# Altium project ESP32-Ethernet-CAN-IR-Relay.PrjPCB
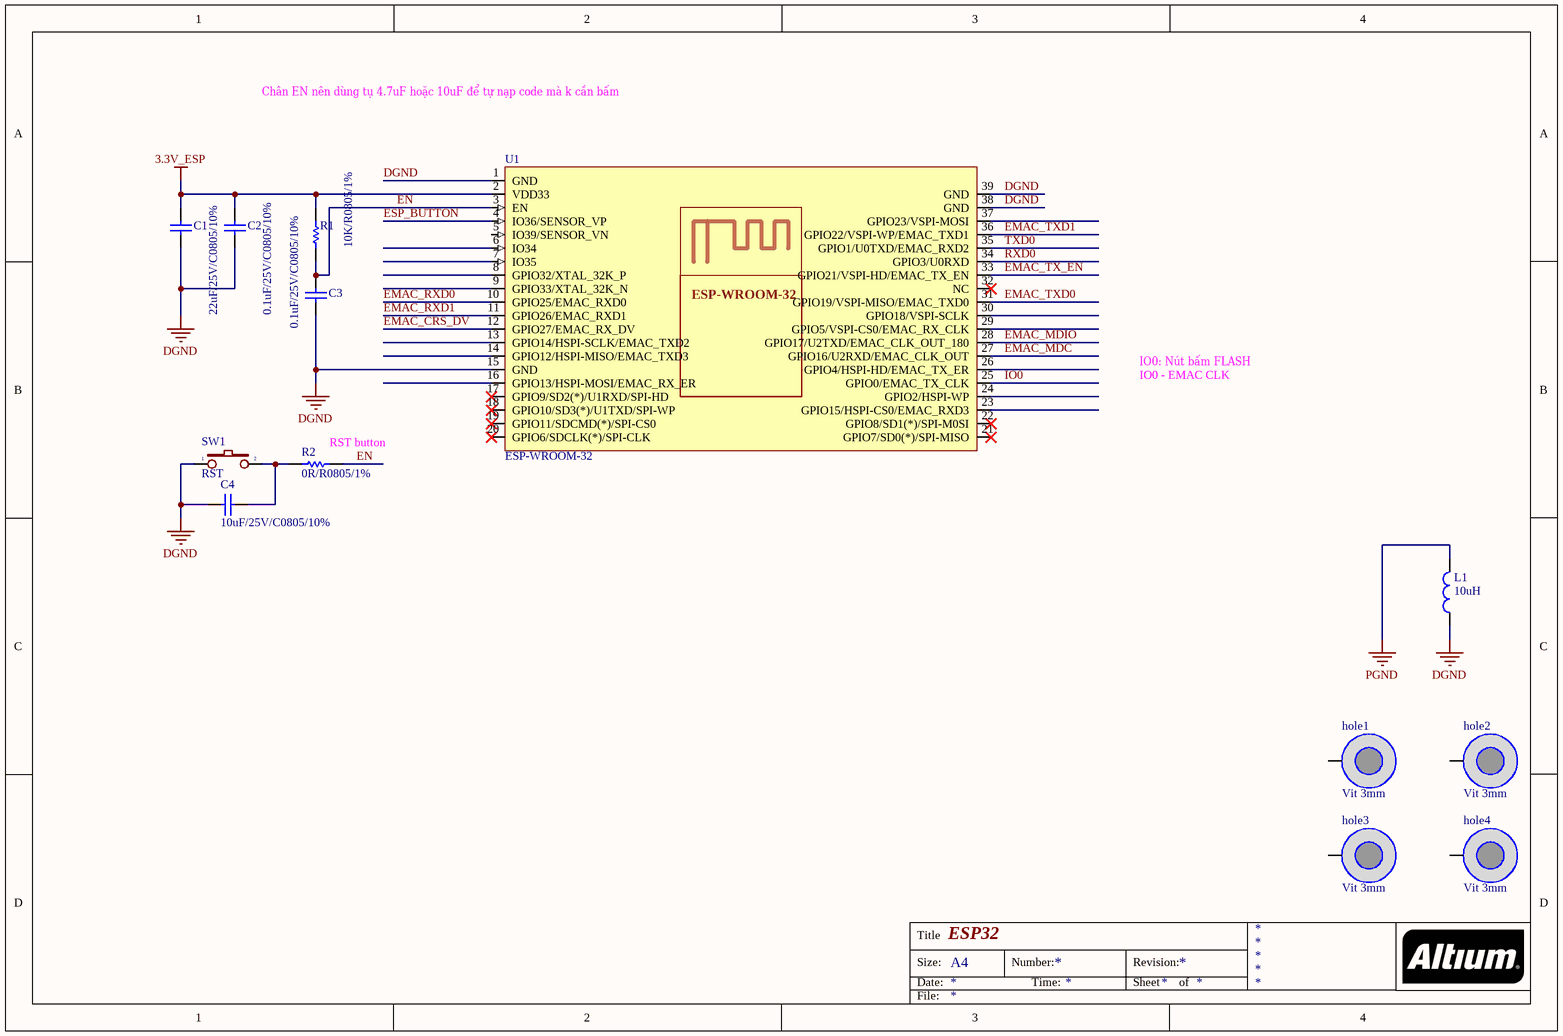
[diagram p0: ESP32.SchDoc]
7 sheets, 158 parts. Net scope: global (net labels, ports and power ports of the same name join across sheets).
Board file: esp_ethernet_can_ir_relay.PcbDoc
Sheets:
  ESP32.SchDoc
  Ethernet.SchDoc
  Input.SchDoc
  Output.SchDoc
  Power.SchDoc
  USB.SchDoc
  CAN.SchDoc

## Sheet ESP32.SchDoc: ESP32
size A4

### Parts
C1  22uF/25V/C0805/10%  [CAP_CERA_C2012(CC0805INCH)]
C2  0.1uF/25V/C0805/10%  [CAP_CERA_C2012(CC0805INCH)]
C3  0.1uF/25V/C0805/10%  [CAP_CERA_C2012(CC0805INCH)]
C4  10uF/25V/C0805/10%  [CAP_CERA_C2012(CC0805INCH)]
hole1  Vit 3mm  [Screw 3.0]
hole2  Vit 3mm  [Screw 3.0]
hole3  Vit 3mm  [Screw 3.0]
hole4  Vit 3mm  [Screw 3.0]
L1  10uH  [L/0.4]
R1  10K/R0805/1%  [Res 0805 SMD]
R2  0R/R0805/1%  [Res 0805 SMD]
SW1  RST  [Button 3x4mm]
U1  ESP-WROOM-32  [ESP32 WROOM]

### Nets
3.3V_ESP: C1.2 C2.2 R1.1 U1.2(VDD33)
DGND: C1.1 C2.1 C3.1 C4.2 L1.1 SW1.1 U1.1(GND) U1.15(GND) U1.38(GND) U1.39(GND)
PGND: L1.2
EMAC_CRS_DV: U1.12(GPIO27/EMAC_RX_DV)
EMAC_MDC: U1.27(GPIO16/U2RXD/EMAC_CLK_OUT)
EMAC_MDIO: U1.28(GPIO17/U2TXD/EMAC_CLK_OUT_180)
EMAC_RXD0: U1.10(GPIO25/EMAC_RXD0)
EMAC_RXD1: U1.11(GPIO26/EMAC_RXD1)
EMAC_TX_EN: U1.33(GPIO21/VSPI-HD/EMAC_TX_EN)
EMAC_TXD0: U1.31(GPIO19/VSPI-MISO/EMAC_TXD0)
EMAC_TXD1: U1.36(GPIO22/VSPI-WP/EMAC_TXD1)
EN: C3.2 R1.2 R2.2 U1.3(EN)
ESP_BUTTON: U1.4(IO36/SENSOR_VP)
IO0: U1.25(GPIO0/EMAC_TX_CLK)
RXD0: U1.34(GPIO3/U0RXD)
TXD0: U1.35(GPIO1/U0TXD/EMAC_RXD2)
NetC4_1: C4.1 R2.1 SW1.2

Not connected (* = marked no-connect by the designer): hole1 1(hole); hole2 1(hole); hole3 1(hole); hole4 1(hole); U1 5(IO39/SENSOR_VN) 6(IO34) 7(IO35) 8(GPIO32/XTAL_32K_P) 9(GPIO33/XTAL_32K_N) 13(GPIO14/HSPI-SCLK/EMAC_TXD2) 14(GPIO12/HSPI-MISO/EMAC_TXD3) 16(GPIO13/HSPI-MOSI/EMAC_RX_ER) 17(GPIO9/SD2(*)/U1RXD/SPI-HD)* 18(GPIO10/SD3(*)/U1TXD/SPI-WP)* 19(GPIO11/SDCMD(*)/SPI-CS0)* 20(GPIO6/SDCLK(*)/SPI-CLK)* 21(GPIO7/SD0(*)/SPI-MISO)* 22(GPIO8/SD1(*)/SPI-M0SI)* 23(GPIO15/HSPI-CS0/EMAC_RXD3) 24(GPIO2/HSPI-WP) 26(GPIO4/HSPI-HD/EMAC_TX_ER) 29(GPIO5/VSPI-CS0/EMAC_RX_CLK) 30(GPIO18/VSPI-SCLK) 32(NC)* 37(GPIO23/VSPI-MOSI)

### Notes on the sheet
- Chân EN nên dùng tụ 4.7uF hoặc 10uF để tự nạp code mà k cần bấm
- IO0: Nút bấm FLASH
- IO0 - EMAC CLK
- (near R2) RST button
- Title
- Size:
- Date:
- A4
- Number:
- Time:
- Revision:
- Sheet
- of
- File:

### Library data of the parts
C1 = 0.1uF/50V/C0603/10%: 22µF ±20% 25V Ceramic Capacitor X5R 0805 (2012 Metric); Manufacturer: Tariff Applied; ComponentLink1URL: http://www.murata.com/~/media/webrenewal/support/library/catalog/products/capacitor/mlcc/c02e.ashx; ComponentLink1Description: http://www.murata.com/~/media/webrenewal/support/library/catalog/products/capacitor/mlcc/c02e.ashx; Digikey: 1276-2908-1-ND
C2-C4 = 0.1uF/50V/C0603/10%: 0.1µF ±10% 25V Ceramic Capacitor X7R 0805 (2012 Metric); ComponentLink1URL: http://www.murata.com/~/media/webrenewal/support/library/catalog/products/capacitor/mlcc/c02e.ashx; ComponentLink1Description: http://www.murata.com/~/media/webrenewal/support/library/catalog/products/capacitor/mlcc/c02e.ashx; Digikey: 478-3755-1-ND
L1 = L1: Inductor; Value: 150 mH
R1 = 200K/R0603/1%: 10 kOhms ±1% 0.125W, 1/8W Chip Resistor 0805 (2012 Metric) Thick Film; Power (Watts): 0.1W, 1/10W; RoHS: RoHS Compliant; Category: Resistors; Part Status: Active; Features: Moisture Resistant; Operating Temperature: -55°C ~ 155°C; Package / Case: 0603 (1608 Metric); Supplier Device Package: 0603; Size / Dimension: 0.063" L x 0.031" W (1.60mm x 0.80mm); Height - Seated (Max): 0.022" (0.55mm); Failure Rate: -; ComponentLink1URL: http://www.yageo.com/documents/recent/PYu-RC_Group_51_RoHS_L_7.pdf; ComponentLink1Description: http://www.yageo.com/documents/recent/PYu-RC_Group_51_RoHS_L_7.pdf; Digikey: A126332CT-ND
R2 = 200K/R0603/1%: 0 Ohms Jumper 0.125W, 1/8W Chip Resistor 0805 (2012 Metric) Automotive AEC-Q200 Thick Film; Part Status: Active; Height - Seated (Max): 0.022" (0.55mm); Failure Rate: -; ComponentLink1URL: http://www.yageo.com/documents/recent/PYu-RC_Group_51_RoHS_L_7.pdf; ComponentLink1Description: http://www.yageo.com/documents/recent/PYu-RC_Group_51_RoHS_L_7.pdf; Digikey: 541-0.0ACT-ND
SW1 = SW2: SWITCH TACTILE SPST-NO 0.05A 12V; Digikey: CKN10384CT-ND
U1 = ESP-WROOM-32: ESP-WROOM-32 (8MB), WIFI MODULE 64 MBITS SPI FLASH; Digikey: 1904-1019-1-ND

## Sheet Ethernet.SchDoc: Ethernet
size A3
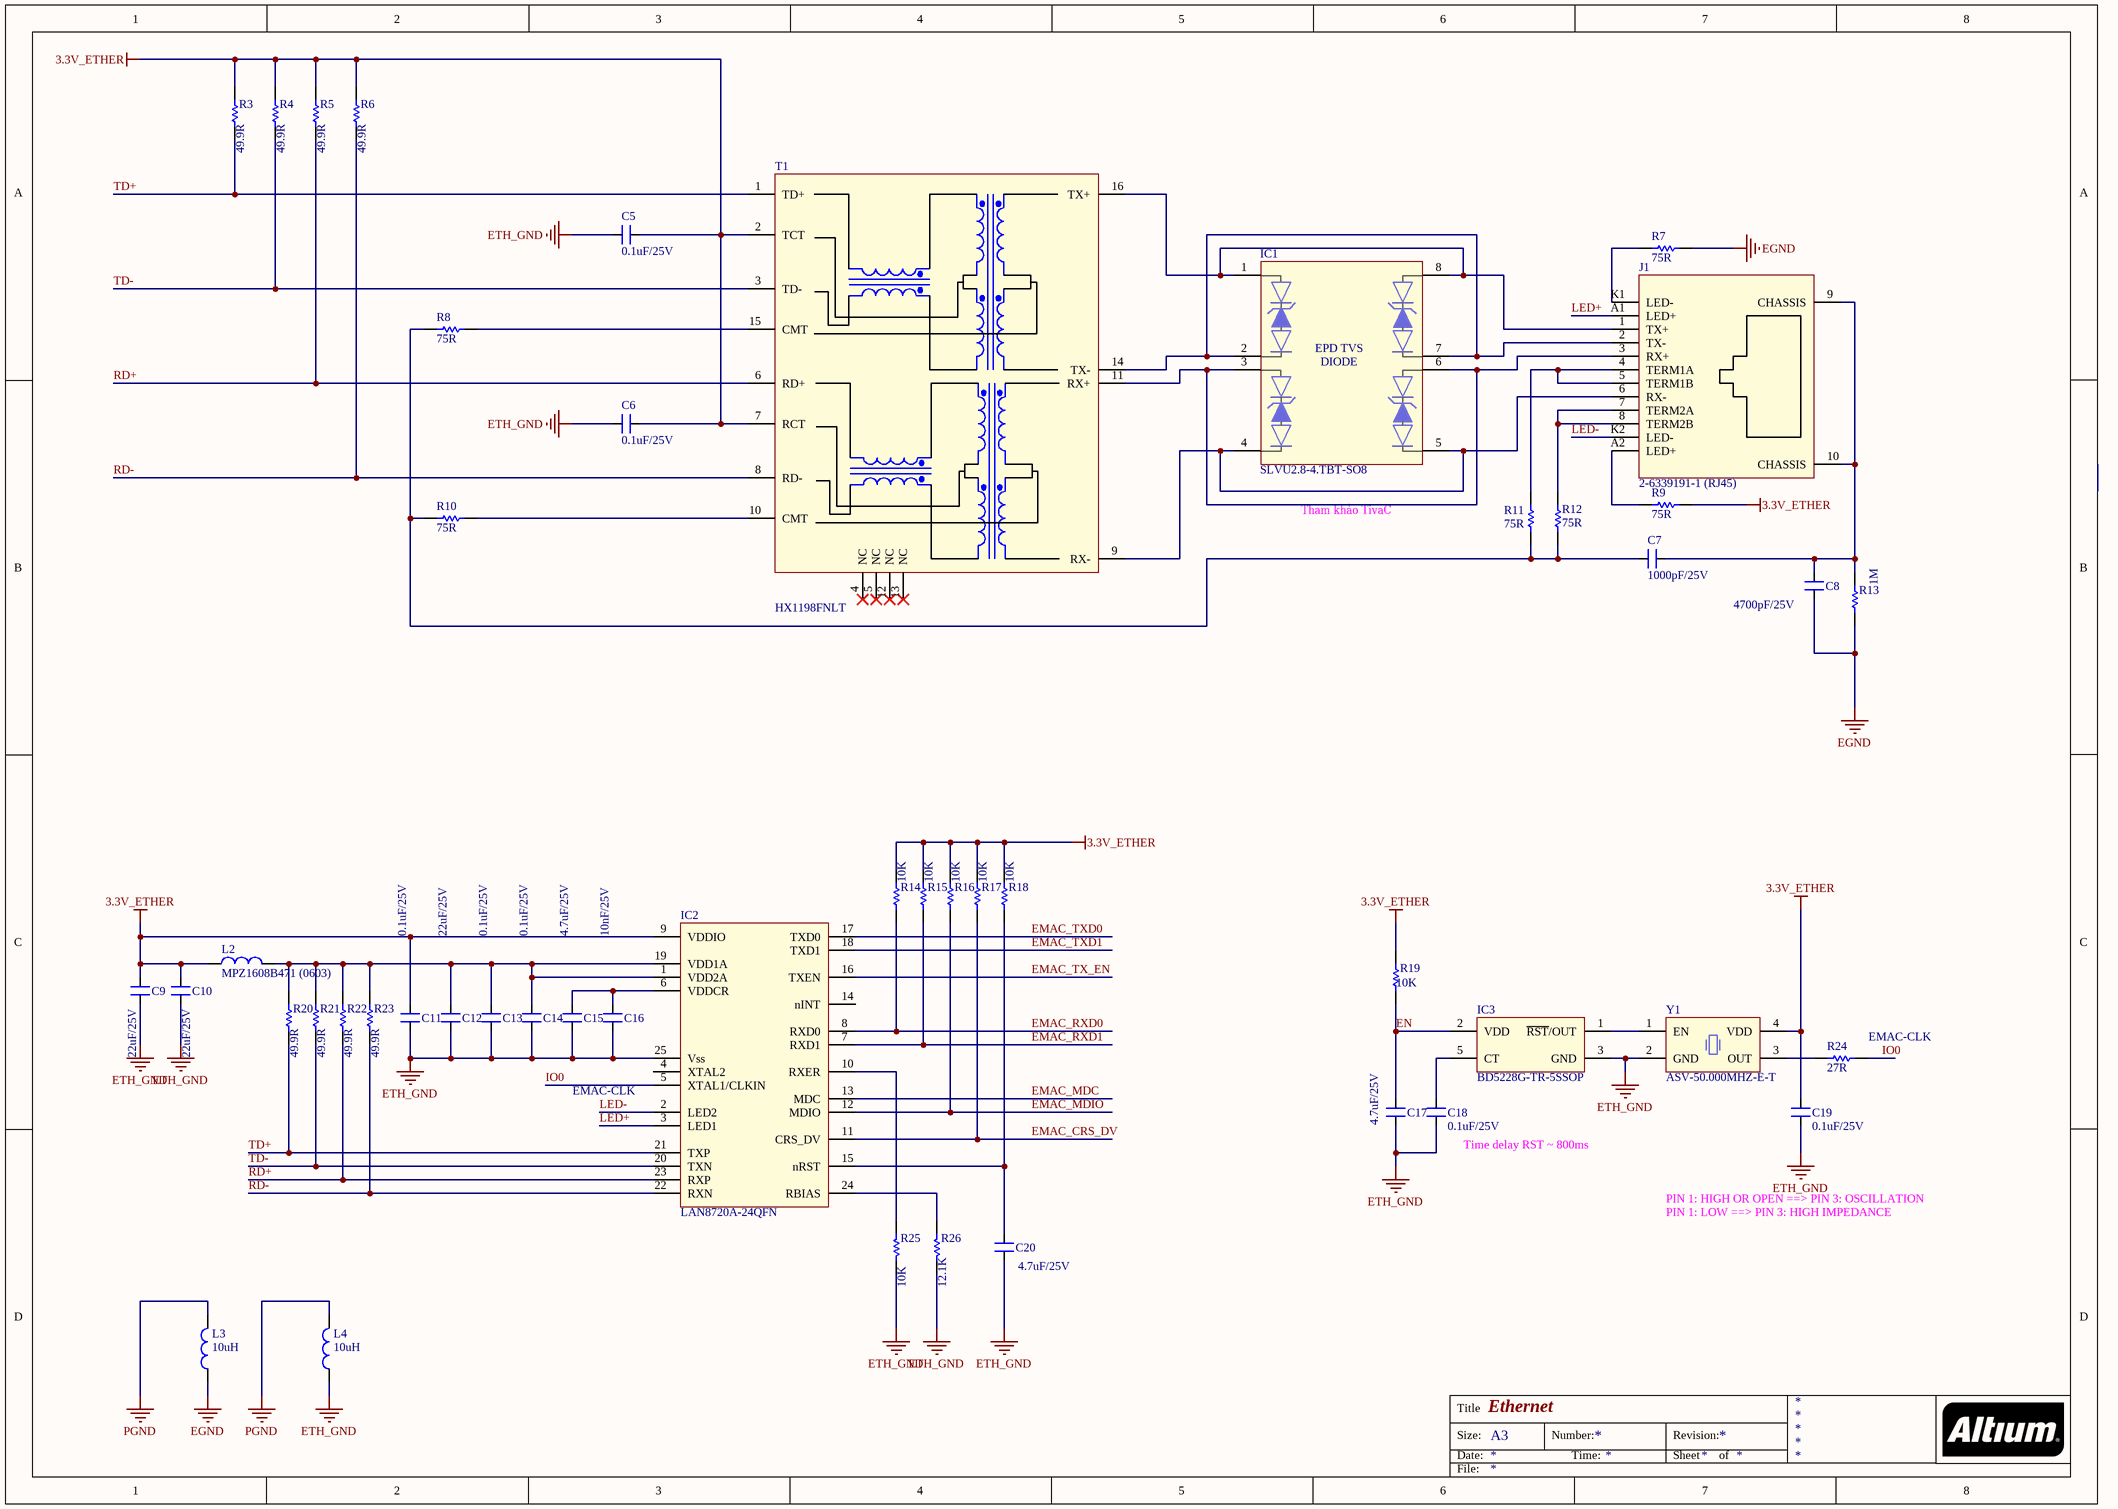
[diagram p1: Ethernet.SchDoc]

### Parts
C5  0.1uF/25V  [CAP_CERA_C2012(CC0805INCH)]
C6  0.1uF/25V  [CAP_CERA_C2012(CC0805INCH)]
C7  1000pF/25V  [CAP_CERA_C2012(CC0805INCH)]
C8  4700pF/25V  [CAP_CERA_C2012(CC0805INCH)]
C9  22uF/25V  [CAP_CERA_C2012(CC0805INCH)]
C10  22uF/25V  [CAP_CERA_C2012(CC0805INCH)]
C11  0.1uF/25V  [CAP_CERA_C2012(CC0805INCH)]
C12  22uF/25V  [CAP_CERA_C2012(CC0805INCH)]
C13  0.1uF/25V  [CAP_CERA_C2012(CC0805INCH)]
C14  0.1uF/25V  [CAP_CERA_C2012(CC0805INCH)]
C15  4.7uF/25V  [CAP_CERA_C2012(CC0805INCH)]
C16  10nF/25V  [CAP_CERA_C2012(CC0805INCH)]
C17  4.7uF/25V  [CAP_CERA_C2012(CC0805INCH)]
C18  0.1uF/25V  [CAP_CERA_C2012(CC0805INCH)]
C19  0.1uF/25V  [CAP_CERA_C2012(CC0805INCH)]
C20  4.7uF/25V  [CAP_CERA_C2012(CC0805INCH)]
IC1  SLVU2.8-4.TBT-SO8  [SLVU2.8-4.TBT - 8S0]
IC2  LAN8720A-24QFN  [LAN8720A 24QFN]
IC3  BD5228G-TR-5SSOP  [BD5228G -5SSOP]
J1  2-6339191-1 (RJ45)  [RJ45-A121555CT-ND]
L2  MPZ1608B471 (0603)  [MPZ1608B471]
L3  10uH  [L/0.4]
L4  10uH  [L/0.4]
R3  49.9R  [Res 0805 SMD]
R4  49.9R  [Res 0805 SMD]
R5  49.9R  [Res 0805 SMD]
R6  49.9R  [Res 0805 SMD]
R7  75R  [Res 0805 SMD]
R8  75R  [Res 0805 SMD]
R9  75R  [Res 0805 SMD]
R10  75R  [Res 0805 SMD]
R11  75R  [Res 0805 SMD]
R12  75R  [Res 0805 SMD]
R13  1M  [Res 0805 SMD]
R14  10K  [Res 0805 SMD]
R15  10K  [Res 0805 SMD]
R16  10K  [Res 0805 SMD]
R17  10K  [Res 0805 SMD]
R18  10K  [Res 0805 SMD]
R19  10K  [Res 0805 SMD]
R20  49.9R  [Res 0805 SMD]
R21  49.9R  [Res 0805 SMD]
R22  49.9R  [Res 0805 SMD]
R23  49.9R  [Res 0805 SMD]
R24  27R  [Res 0805 SMD]
R25  10K  [Res 0805 SMD]
R26  12.1K  [Res 0805 SMD]
T1  HX1198FNLT  [HX1198FNL]
Y1  ASV-50.000MHZ-E-T  [CR_ASV_50.000MHZ]

### Nets
3.3V_ETHER: C5.1 C6.1 C9.2 C10.2 C11.2 C19.2 IC2.9(VDDIO) L2.1 R3.1 R4.1 R5.1 R6.1 R9.1 R14.1 R15.1 R16.1 R17.1 R18.1 R19.1 T1.2(TCT) T1.7(RCT) Y1.4(VDD)
EGND: C8.2 L3.1 R7.1 R13.1
ETH_GND: C5.2 C6.2 C9.1 C10.1 C11.1 C12.1 C13.1 C14.1 C15.1 C16.1 C17.1 C18.1 C19.1 C20.1 IC2.25(Vss) IC3.3(GND) L4.1 R25.2 R26.2 Y1.2(GND)
PGND: L3.2 L4.2
EMAC_CRS_DV: IC2.11(CRS_DV) R17.2
EMAC_MDC: IC2.13(MDC)
EMAC_MDIO: IC2.12(MDIO) R16.2
EMAC_RXD0: IC2.8(RXD0) R14.2
EMAC_RXD1: IC2.7(RXD1) R15.2
EMAC_TX_EN: IC2.16(TXEN)
EMAC_TXD0: IC2.17(TXD0)
EMAC_TXD1: IC2.18(TXD1)
EN: C17.2 IC3.2(VDD) R19.2
IO0: IC2.5(XTAL1/CLKIN) R24.2
LED+: IC2.3(LED1) J1.A1(LED+)
LED-: IC2.2(LED2) J1.K2(LED-)
RD+: IC2.23(RXP) R5.2 R22.1 T1.6(RD+)
RD-: IC2.22(RXN) R6.2 R23.1 T1.8(RD-)
TD+: IC2.21(TXP) R3.2 R20.1 T1.1(TD+)
TD-: IC2.20(TXN) R4.2 R21.1 T1.3(TD-)
NetC7_1: C7.1 C8.1 J1.9(CHASSIS) J1.10(CHASSIS) R13.2
NetC7_2: C7.2 R8.2 R10.2 R11.1 R12.1
NetC12_2: C12.2 C13.2 C14.2 IC2.1(VDD2A) IC2.19(VDD1A) L2.2 R20.2 R21.2 R22.2 R23.2
NetC15_2: C15.2 C16.2 IC2.6(VDDCR)
NetC18_2: C18.2 IC3.5(CT)
NetC20_2: C20.2 IC2.15(nRST) R18.2
NetIC1_1: IC1.1(A1) IC1.8(A1) J1.1(TX+) T1.16(TX+)
NetIC1_2: IC1.2(K1) IC1.7(K1) J1.2(TX-) T1.14(TX-)
NetIC1_3: IC1.3(A1) IC1.6(A1) J1.3(RX+) T1.11(RX+)
NetIC1_4: IC1.4(K1) IC1.5(K1) J1.6(RX-) T1.9(RX-)
NetIC2_10: IC2.10(RXER) R25.1
NetIC2_24: IC2.24(RBIAS) R26.1
NetIC3_1: IC3.1(~{RST}/OUT) Y1.1(EN)
NetJ1_4: J1.4(TERM1A) J1.5(TERM1B) R11.2
NetJ1_7: J1.7(TERM2A) J1.8(TERM2B) R12.2
NetJ1_A2: J1.A2(LED+) R9.2
NetJ1_K1: J1.K1(LED-) R7.2
NetR8_1: R8.1 T1.15(CMT)
NetR10_1: R10.1 T1.10(CMT)
NetR24_1: R24.1 Y1.3(OUT)

Not connected (* = marked no-connect by the designer): IC2 4(XTAL2) 14(nINT); T1 4(NC)* 5(NC)* 12(NC)* 13(NC)*

### Notes on the sheet
- Tham khảo TivaC
- (near R24) EMAC-CLK
- EMAC-CLK
- (near C18) Time delay RST ~ 800ms
- PIN 1: HIGH OR OPEN ==> PIN 3: OSCILLATION
- PIN 1: LOW ==> PIN 3: HIGH IMPEDANCE
- Title
- Size:
- Date:
- A3
- Number:
- Time:
- Revision:
- Sheet
- of
- File:
- (in symbol SLVU2.8-4.TBT) EPD TVS; DIODE

### Library data of the parts
C5 C6 C11 C13 C14 C18 C19 = CAP CERA 0805: 0.1µF ±10% 25V Ceramic Capacitor X7R 0805 (2012 Metric); Value: 100pF, 2012; Digikey: 478-3755-1-ND
C7 = CAP CERA 0805: 1000pF ±10% 25V Ceramic Capacitor X7R 0805 (2012 Metric); Manufacturrer: Wurth Electronics Inc.; Digikey: 732-8050-1-ND
C8 = CAP CERA 0805: 4700pF ±10% 25V Ceramic Capacitor X7R 0805 (2012 Metric); Manufacturrer: KEMET; Digikey: 399-14606-1-ND
C9 C10 C12 = CAP CERA 0805: 22µF ±20% 25V Ceramic Capacitor X5R 0805 (2012 Metric); Digikey: 1276-2908-1-ND
C15 C17 C20 = CAP CERA 0805: 4.7µF ±10% 25V Ceramic Capacitor X5R 0805 (2012 Metric); Digikey: 399-5505-1-ND
C16 = CAP CERA 0805: 1nF=1000pF ±10% 25V Ceramic Capacitor X7R 0805 (2012 Metric); Digikey: 399-7994-1-ND
IC1 = SLVU2.8-4.TBT: TVS DIODE 2.8V 15V 8SO, EPD TVS Diode Array For ESD and Latch-Up Protection; Digikey: SLVU2.8-4CT-ND
IC2 = LAN8720A-24QFN: IC TXRX ETHERNET 24QFN,  2/2 Transceiver Full RMII 24-QFN (4x4); Digikey: LAN8720A-CP-CT-ND
IC3 = BD5228G-5SSOP: IC DETECTOR VOLT 2.8V ODRN 5SSOP; Digikey: BD5228GCT-ND
J1 = RJ45-2-6339191-1: Jack Modular Connector 8p8c (RJ45, Ethernet) 90° Angle (Right) Shielded, EMI Finger Cat5; Digikey: A121555CT-ND
L2 = L1: FERRITE BEAD 470 OHM 0603 1LN; Digikey: 445-5218-1-ND
L3 L4 = L1: Inductor; Value: 150 mH
R3-R6 R20-R23 = RES-0805: 49.9 Ohms ±1% 0.15W Chip Resistor 0805 (2012 Metric) Military Thick Film; ComponentLink1URL: http://www.yageo.com/documents/recent/PYu-RC_Group_51_RoHS_L_8.pdf; ComponentLink1Description: http://www.yageo.com/documents/recent/PYu-RC_Group_51_RoHS_L_8.pdf; Digikey: 1135-1012-1-ND
R7-R12 = RES-0805: 75 Ohms ±1% 0.125W, 1/8W Chip Resistor 0805 (2012 Metric) Automotive AEC-Q200 Thick Film; ComponentLink1URL: http://www.yageo.com/documents/recent/PYu-RC_Group_51_RoHS_L_8.pdf; ComponentLink1Description: http://www.yageo.com/documents/recent/PYu-RC_Group_51_RoHS_L_8.pdf; Digikey: P75.0CCT-ND
R13 = RES-0805: 1 MOhms ±1% 0.125W, 1/8W Chip Resistor 0805 (2012 Metric) Automotive AEC-Q200 Thick Film; ComponentLink1URL: http://www.yageo.com/documents/recent/PYu-RC_Group_51_RoHS_L_8.pdf; ComponentLink1Description: http://www.yageo.com/documents/recent/PYu-RC_Group_51_RoHS_L_8.pdf; Digikey: P1.00MCCT-ND
R14-R19 R25 = RES-0805: RES SMD 249K OHM 1% 1/10W 0805; Manufacturer: Yageo; Manufacturer Part Number: RC0603FR-07249KL; Power (Watts): 0.1W, 1/10W; Temperature Coefficient: ±100ppm/°C; Supplier 1: Digi-Key; RoHS: RoHS Compliant; Category: Resistors; Stock 1: 370515; Pricing 1: 1=0.1, 10=0.015, 100=0.006, 1000=0.00268, 2500=0.00233 (USD); Packaging: Cut Tape (CT); Part Status: Active; Tolerance: ±1%; Composition: Thick Film; Features: Moisture Resistant; Operating Temperature: -55°C ~ 155°C; Package / Case: 0603 (1608 Metric); Supplier Device Package: 0603; Size / Dimension: 0.063" L x 0.032" W (1.60mm x 0.80mm); Height - Seated (Max): 0.022" (0.55mm); Failure Rate: -; ComponentLink1URL: http://www.yageo.com/documents/recent/PYu-RC_Group_51_RoHS_L_8.pdf; ComponentLink1Description: http://www.yageo.com/documents/recent/PYu-RC_Group_51_RoHS_L_8.pdf
R24 = RES-0805: 27 Ohms ±1% 0.125W, 1/8W Chip Resistor 0805 (2012 Metric) Automotive AEC-Q200 Thick Fil; ComponentLink1URL: http://www.yageo.com/documents/recent/PYu-RC_Group_51_RoHS_L_8.pdf; ComponentLink1Description: http://www.yageo.com/documents/recent/PYu-RC_Group_51_RoHS_L_8.pdf; Digikey: P27.0CCT-ND
R26 = RES-0805: 12.1 kOhms ±1% 0.125W, 1/8W Chip Resistor 0805 (2012 Metric) Automotive AEC-Q200 Thick Film; ComponentLink1URL: http://www.yageo.com/documents/recent/PYu-RC_Group_51_RoHS_L_8.pdf; ComponentLink1Description: http://www.yageo.com/documents/recent/PYu-RC_Group_51_RoHS_L_8.pdf; Digikey: P12.1KCCT-ND
T1 = HX1198FNLT: PULSE XFMR 1CT:1CT TX 1CT:1CT RX; Digikey: 553-2209-1-ND
Y1 = CRYSTAL_ASV: 50MHz XO (Standard) HCMOS Oscillator 3.3V Enable/Disable 4-SMD, No Lead; ComponentLink1Description: Datasheet; Digikey: 535-10087-1-ND

## Sheet Input.SchDoc: INPUT
size A4
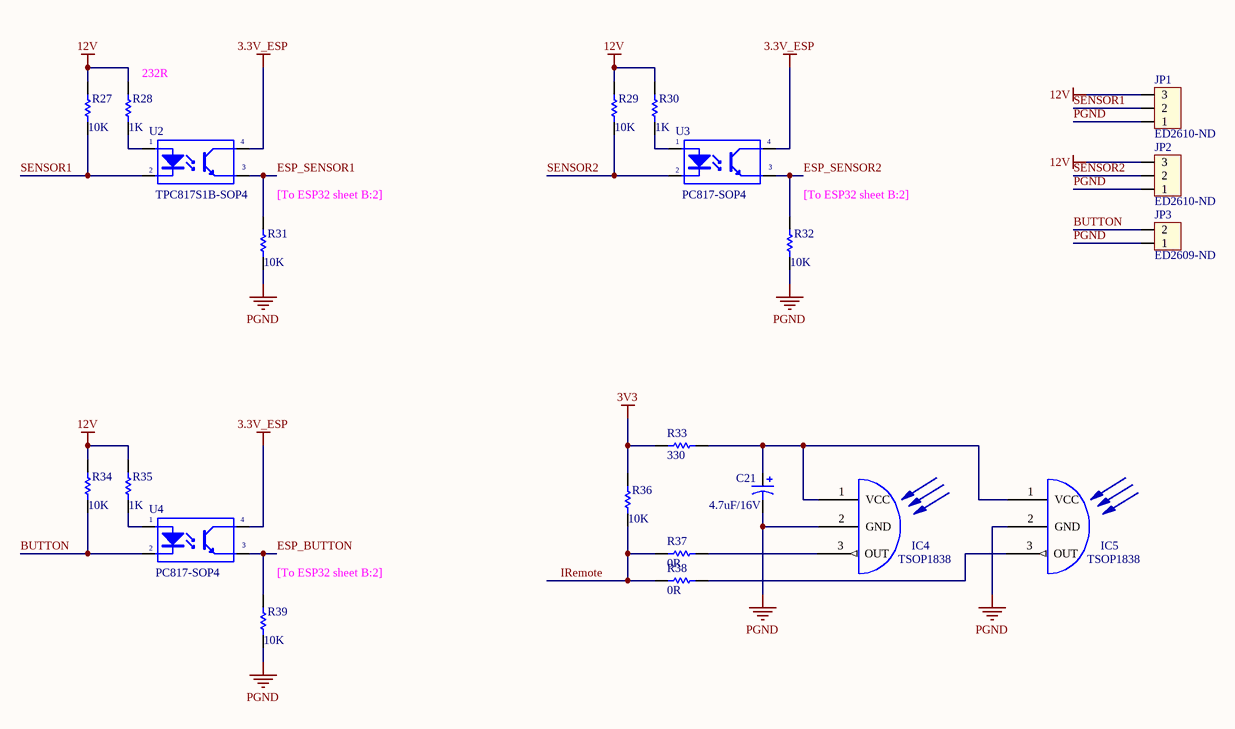
[diagram p2: Input.SchDoc]

### Parts
C21  value 4.7uF/16V  [C0805]  (hidden comment: Cap Pol1)
IC4  TSOP1838  [TSOP1838]
IC5  TSOP1838  [TSOP1838]
JP1  ED2610-ND  [DOMINO_OSTTC_3P]
JP2  ED2610-ND  [DOMINO_OSTTC_3P]
JP3  ED2609-ND  [DOMINO_OSTTC_2P]
R27  10K  [Res 0805 SMD]
R28  1K  [Res 0805 SMD]
R29  10K  [Res 0805 SMD]
R30  1K  [Res 0805 SMD]
R31  10K  [Res 0805 SMD]
R32  10K  [Res 0805 SMD]
R33  330  [Res 0805 SMD]
R34  10K  [Res 0805 SMD]
R35  1K  [Res 0805 SMD]
R36  10K  [Res 0805 SMD]
R37  0R  [Res 0805 SMD]
R38  0R  [Res 0805 SMD]
R39  10K  [Res 0805 SMD]
U2  TPC817S1B-SOP4  [TPC817-4SOP]
U3  PC817-SOP4  [TPC817-4SOP]
U4  PC817-SOP4  [TPC817-4SOP]

### Nets
3.3V_ESP: U2.4(C) U3.4(C) U4.4(C)
3V3: R33.2 R36.2
12V: JP1.3 JP2.3 R27.2 R28.2 R29.2 R30.2 R34.2 R35.2
PGND: C21.2 IC4.2(GND) IC5.2(GND) JP1.1 JP2.1 JP3.1 R31.1 R32.1 R39.1
BUTTON: JP3.2 R34.1 U4.2(K)
ESP_BUTTON: R39.2 U4.3(E)
ESP_SENSOR1: R31.2 U2.3(E)
ESP_SENSOR2: R32.2 U3.3(E)
IRemote: R36.1 R37.2 R38.2
SENSOR1: JP1.2 R27.1 U2.2(K)
SENSOR2: JP2.2 R29.1 U3.2(K)
NetC21_1: C21.1 IC4.1(VCC) IC5.1(VCC) R33.1
NetIC4_3: IC4.3(OUT) R37.1
NetIC5_3: IC5.3(OUT) R38.1
NetR28_1: R28.1 U2.1(A)
NetR30_1: R30.1 U3.1(A)
NetR35_1: R35.1 U4.1(A)

### Notes on the sheet
- (near R28) 232R
- [To ESP32 sheet B:2]
- Title
- Size:
- Date:
- A4
- Number:
- Time:
- Revision:
- Sheet
- of
- File:

### Library data of the parts
C21 = Cap Pol1: Polarized Capacitor (Radial); Published: 8-Jun-2000; LatestRevisionDate: 17-Jul-2002; LatestRevisionNote: Re-released for DXP Platform.; PackageReference: RB7.6-15; Publisher: Altium Limited; PackageDescription: Polarized Capacitor (Radial); 2 Leads
JP1 JP2 = Con3: 3 Position Wire to Board Terminal Block Horizontal with Board 0.200" (5.08mm) Through Hole; Value: Connector 3; Digikey: ED2610-ND
JP3 = Con2: 2 Position Wire to Board Terminal Block Horizontal with Board 0.200" (5.08mm) Through Hole; Value: Connector 2; Digikey: ED2609-ND
R27 R29 R34 = 10K/R0603/1%: RES SMD 10K OHM 1% 1/10W 0603; Manufacturer: Yageo; Manufacturer Part Number: RC0603FR-0710KL; Power (Watts): 0.1W, 1/10W; Temperature Coefficient: ±100ppm/°C; Supplier 1: Digi-Key; RoHS: RoHS Compliant; Category: Resistors; Stock 1: 11440000; Pricing 1: 5000=0.00167, 10000=0.00145, 25000=0.00128, 50000=0.00117, 125000=0.00115 (USD); Packaging: Tape & Reel (TR); Resistance (Ohms): 10k; Tolerance: ±1%; Composition: Thick Film; Features: Moisture Resistant; Operating Temperature: -55°C ~ 155°C; Package / Case: 0603 (1608 Metric); Supplier Device Package: 0603; Size / Dimension: 0.063" L x 0.031" W (1.60mm x 0.80mm); Height: 0.022" (0.55mm); Number of Terminations: 2; ComponentLink1URL: http://www.yageo.com/NewPortal/yageodocoutput?fileName=/pdf/R-Chip/PYu-RC_Group_51_RoHS_L_3.pdf; ComponentLink1Description: http://www.yageo.com/NewPortal/yageodocoutput?fileName=/pdf/R-Chip/PYu-RC_Group_51_RoHS_L_3.pdf; Supplier Part Number 1: 311-10.0KHRTR-ND
R28 R30 R35 = 10K/R0603/1%: 1 kOhms ±1% 0.125W, 1/8W Chip Resistor 0805 (2012 Metric) Automotive AEC-Q200 Thick Film; Resistance (Ohms): 10k; Power (Watts): 0.1W, 1/10W; RoHS: RoHS Compliant; Category: Resistors; Features: Moisture Resistant; Operating Temperature: -55°C ~ 155°C; Package / Case: 0603 (1608 Metric); Supplier Device Package: 0603; Size / Dimension: 0.063" L x 0.031" W (1.60mm x 0.80mm); Height: 0.022" (0.55mm); Number of Terminations: 2; ComponentLink1URL: http://www.yageo.com/NewPortal/yageodocoutput?fileName=/pdf/R-Chip/PYu-RC_Group_51_RoHS_L_3.pdf; ComponentLink1Description: http://www.yageo.com/NewPortal/yageodocoutput?fileName=/pdf/R-Chip/PYu-RC_Group_51_RoHS_L_3.pdf; Digikey: 541-1.00KCCT-ND
R31-R33 R36-R39 = 249K/R0805/1%: RES SMD 249K OHM 1% 1/10W 0805; Manufacturer: Yageo; Manufacturer Part Number: RC0603FR-07249KL; Power (Watts): 0.1W, 1/10W; Temperature Coefficient: ±100ppm/°C; Supplier 1: Digi-Key; RoHS: RoHS Compliant; Category: Resistors; Stock 1: 370515; Pricing 1: 1=0.1, 10=0.015, 100=0.006, 1000=0.00268, 2500=0.00233 (USD); Packaging: Cut Tape (CT); Part Status: Active; Tolerance: ±1%; Composition: Thick Film; Features: Moisture Resistant; Operating Temperature: -55°C ~ 155°C; Package / Case: 0603 (1608 Metric); Supplier Device Package: 0603; Size / Dimension: 0.063" L x 0.032" W (1.60mm x 0.80mm); Height - Seated (Max): 0.022" (0.55mm); Failure Rate: -; ComponentLink1URL: http://www.yageo.com/documents/recent/PYu-RC_Group_51_RoHS_L_8.pdf; ComponentLink1Description: http://www.yageo.com/documents/recent/PYu-RC_Group_51_RoHS_L_8.pdf
U2-U4 = PC817: Optoisolator Transistor Output 5000Vrms 1 Channel 4-SOP; Digikey: TPC817S1BRAGCT-ND
  U3 U4: BuyVN: https://banlinhkien.vn/goods-1134-pc817-el817-sop4-opto.html

## Sheet Output.SchDoc: OUTPUT
size A4
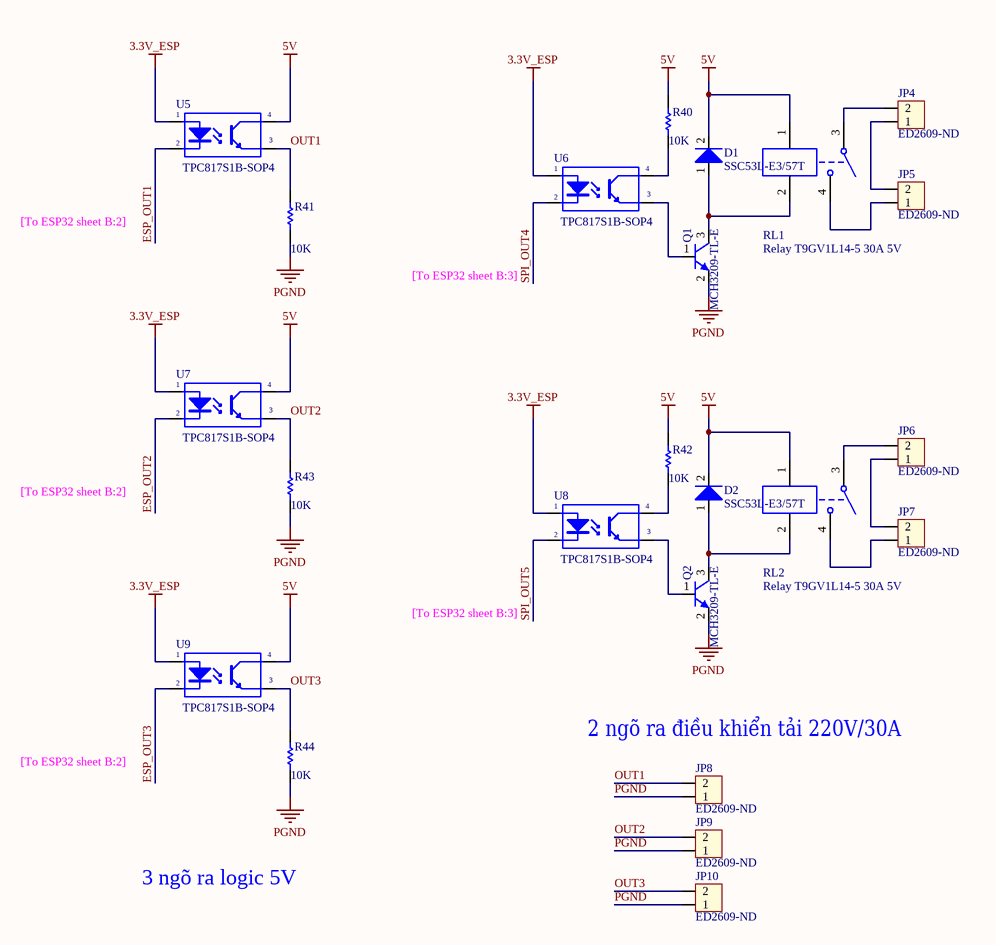
[diagram p3: Output.SchDoc]

### Parts
D1  SSC53L-E3/57T  [SSC53L-E3/57T]
D2  SSC53L-E3/57T  [SSC53L-E3/57T]
JP4  ED2609-ND  [DOMINO_OSTTC_2P]
JP5  ED2609-ND  [DOMINO_OSTTC_2P]
JP6  ED2609-ND  [DOMINO_OSTTC_2P]
JP7  ED2609-ND  [DOMINO_OSTTC_2P]
JP8  ED2609-ND  [DOMINO_OSTTC_2P]
JP9  ED2609-ND  [DOMINO_OSTTC_2P]
JP10  ED2609-ND  [DOMINO_OSTTC_2P]
Q1  MCH3209-TL-E  [MCH3209-TL-E  SOT-323]
Q2  MCH3209-TL-E  [MCH3209-TL-E  SOT-323]
R40  10K  [Res 0805 SMD]
R41  10K  [Res 0805 SMD]
R42  10K  [Res 0805 SMD]
R43  10K  [Res 0805 SMD]
R44  10K  [Res 0805 SMD]
RL1  Relay T9GV1L14-5 30A 5V  [Relay T9GV1L14-5 30A 5V]
RL2  Relay T9GV1L14-5 30A 5V  [Relay T9GV1L14-5 30A 5V]
U5  TPC817S1B-SOP4  [TPC817-4SOP]
U6  TPC817S1B-SOP4  [TPC817-4SOP]
U7  TPC817S1B-SOP4  [TPC817-4SOP]
U8  TPC817S1B-SOP4  [TPC817-4SOP]
U9  TPC817S1B-SOP4  [TPC817-4SOP]

### Nets
3.3V_ESP: U5.1(A) U6.1(A) U7.1(A) U8.1(A) U9.1(A)
5V: D1.2(K) D2.2(K) R40.2 R42.2 RL1.1 RL2.1 U5.4(C) U7.4(C) U9.4(C)
PGND: JP8.1 JP9.1 JP10.1 Q1.2(E) Q2.2(E) R41.1 R43.1 R44.1
ESP_OUT1: U5.2(K)
ESP_OUT2: U7.2(K)
ESP_OUT3: U9.2(K)
OUT1: JP8.2 R41.2 U5.3(E)
OUT2: JP9.2 R43.2 U7.3(E)
OUT3: JP10.2 R44.2 U9.3(E)
SPI_OUT4: U6.2(K)
SPI_OUT5: U8.2(K)
NetD1_1: D1.1(A) Q1.3(C) RL1.2
NetD2_1: D2.1(A) Q2.3(C) RL2.2
NetJP4_1: JP4.1 JP5.2
NetJP4_2: JP4.2 RL1.3
NetJP5_1: JP5.1 RL1.4
NetJP6_1: JP6.1 JP7.2
NetJP6_2: JP6.2 RL2.3
NetJP7_1: JP7.1 RL2.4
NetQ1_1: Q1.1(B) U6.3(E)
NetQ2_1: Q2.1(B) U8.3(E)
NetR40_1: R40.1 U6.4(C)
NetR42_1: R42.1 U8.4(C)

### Notes on the sheet
- [To ESP32 sheet B:2]
- [To ESP32 sheet B:3]
- (near JP8) 2 ngõ ra điều khiển tải 220V/30A
- 3 ngõ ra logic 5V
- Title
- Size:
- Date:
- A4
- Number:
- Time:
- Revision:
- Sheet
- of
- File:

### Library data of the parts
D1 D2 = 10A10: DIODE SCHOTTKY 30V 5A DO214AB; ComponentLink1Description: Datasheet; ComponentLink1URL: D:\Dropbox\Datasheets\Diodes and Rectifiers\Diodes\10AXX.pdf; Digikey: SSC53L-E3/57TGICT-ND
JP4-JP10 = Con2: as JP3 on sheet Input; Digikey: ED2609-ND
Q1 Q2 = 2SC1815: Bipolar (BJT) Transistor NPN 30V 3A 450MHz 800mW Surface Mount 3-MCPH; ComponentLink1Description: Datasheet; ComponentLink1URL: D:\Dropbox\Datasheets\Transistors\P Channel Bipolar\2SC1815.pdf; Digikey: MCH3209-TL-EOSCT-ND
R40-R44 = 249K/R0805/1%: as R31 on sheet Input; Supplier 1: Digi-Key; RoHS: RoHS Compliant; Category: Resistors; Stock 1: 370515; Pricing 1: 1=0.1, 10=0.015, 100=0.006, 1000=0.00268, 2500=0.00233 (USD); Packaging: Cut Tape (CT); Part Status: Active; Tolerance: ±1%; Composition: Thick Film; Features: Moisture Resistant; Operating Temperature: -55°C ~ 155°C; Package / Case: 0603 (1608 Metric); Supplier Device Package: 0603; Size / Dimension: 0.063" L x 0.032" W (1.60mm x 0.80mm); Height - Seated (Max): 0.022" (0.55mm); Failure Rate: -; ComponentLink1URL: http://www.yageo.com/documents/recent/PYu-RC_Group_51_RoHS_L_8.pdf; ComponentLink1Description: http://www.yageo.com/documents/recent/PYu-RC_Group_51_RoHS_L_8.pdf
RL1 RL2 = Relay T9GV1L14-5 30A 5V: General Purpose Relay SPST-NO (1 Form A) 5VDC Coil Through Hole; Digikey: T9GV1L14-5
U5-U9 = PC817: as U2 on sheet Input; Digikey: TPC817S1BRAGCT-ND

## Sheet Power.SchDoc: POWER
size A3
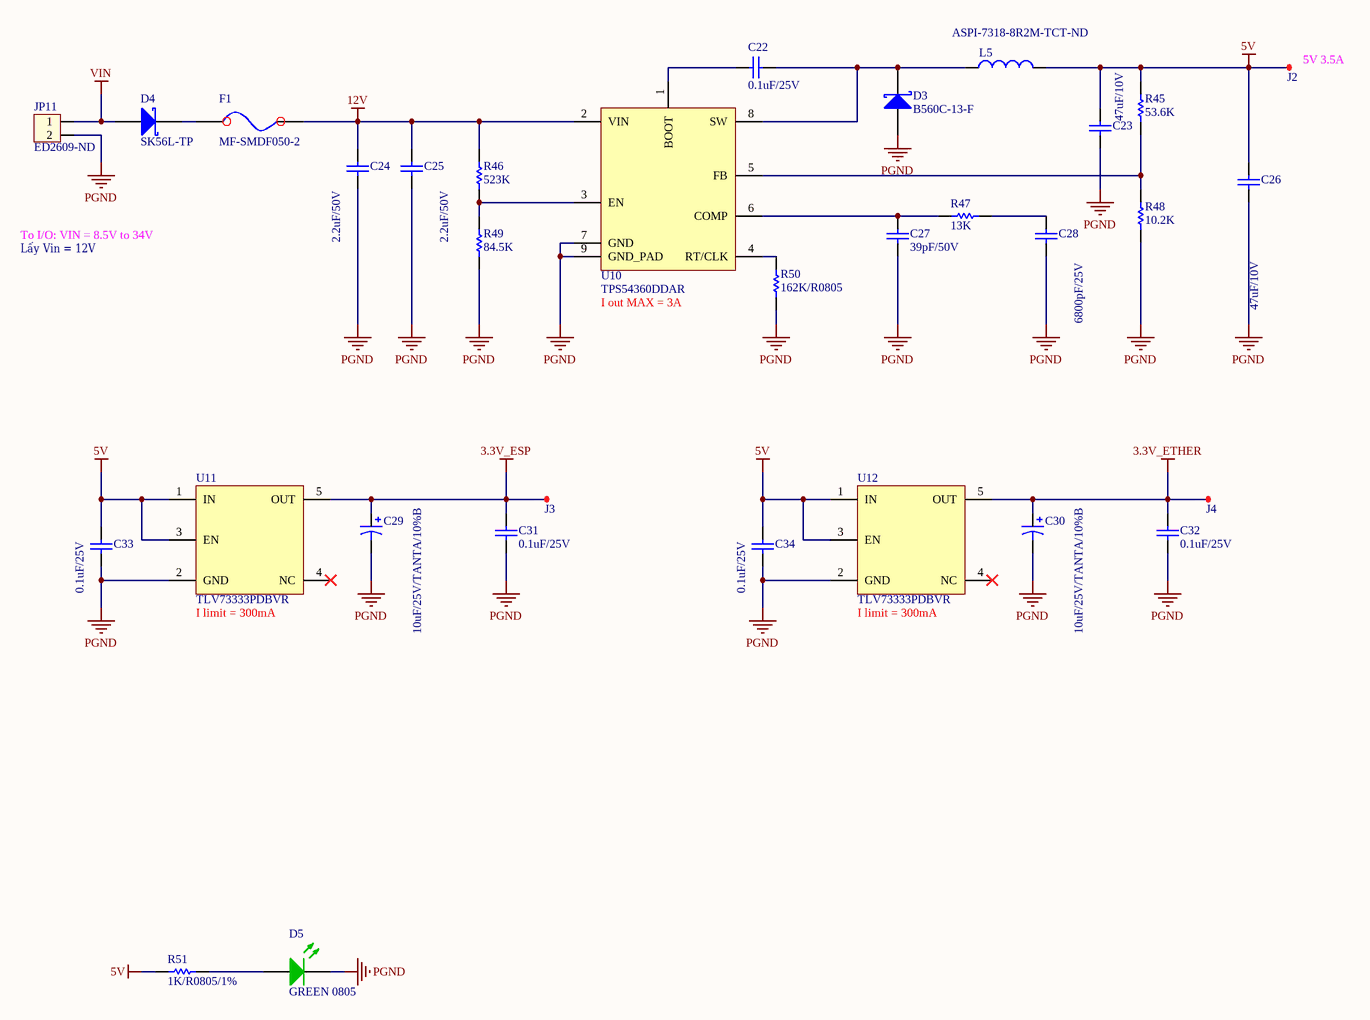
[diagram p4: Power.SchDoc]

### Parts
C22  0.1uF/25V  [CAP_CERA_C2012(CC0805INCH)]
C23  47uF/10V  [CAP_CERA_C2012(CC0805INCH)]
C24  2.2uF/50V  [CAP_CERA_C2012(CC0805INCH)]
C25  2.2uF/50V  [CAP_CERA_C2012(CC0805INCH)]
C26  47uF/10V  [CAP_CERA_C2012(CC0805INCH)]
C27  39pF/50V  [CAP_CERA_C2012(CC0805INCH)]
C28  6800pF/25V  [CAP_CERA_C2012(CC0805INCH)]
C29  10uF/25V/TANTA/10%B  [CAP TANT CASE B SMD]
C30  10uF/25V/TANTA/10%B  [CAP TANT CASE B SMD]
C31  0.1uF/25V  [CAP_CERA_C2012(CC0805INCH)]
C32  0.1uF/25V  [CAP_CERA_C2012(CC0805INCH)]
C33  0.1uF/25V  [CAP_CERA_C2012(CC0805INCH)]
C34  0.1uF/25V  [CAP_CERA_C2012(CC0805INCH)]
D3  B560C-13-F  [2# B560C]
D4  SK56L-TP  [30# SK56L-TPMSCT-ND]
D5  GREEN 0805  [Led 0805G]
F1  MF-SMDF050-2  [13# MF-SMDF050]
J2  TEST POINT  [TEST POINT 1mm]  (value not drawn)
J3  TEST POINT  [TEST POINT 1mm]  (value not drawn)
J4  TEST POINT  [TEST POINT 1mm]  (value not drawn)
JP11  ED2609-ND  [DOMINO_OSTTC_2P]
L5  ASPI-7318-8R2M-TCT-ND  [ASPI-7318-8R2M-TCT-ND]
R45  53.6K  [Res 0805 SMD]
R46  523K  [Res 0805 SMD]
R47  13K  [Res 0805 SMD]
R48  10.2K  [Res 0805 SMD]
R49  84.5K  [Res 0805 SMD]
R50  162K/R0805  [Res 0805 SMD]
R51  1K/R0805/1%  [Res 0805 SMD]
U10  TPS54360DDAR  [21# TPS54360]
U11  TLV73333PDBVR  [20# TLV73333PDBVR - SOT23-65]
U12  TLV73333PDBVR  [20# TLV73333PDBVR - SOT23-65]

### Nets
3.3V_ESP: C29.1 C31.2 J3.1(TP) U11.5(OUT)
3.3V_ETHER: C30.1 C32.2 J4.1(TP) U12.5(OUT)
5V: C23.2 C26.2 C33.2 C34.2 J2.1(TP) L5.2 R45.2 R51.1 U11.1(IN) U11.3(EN) U12.1(IN) U12.3(EN)
12V: C24.2 C25.2 F1.2(OUT) R46.2 U10.2(VIN)
PGND: C23.1 C24.1 C25.1 C26.1 C27.1 C28.1 C29.2 C30.2 C31.1 C32.1 C33.1 C34.1 D3.1(A) D5.2(K) JP11.2 R48.1 R49.1 R50.2 U10.7(GND) U10.9(GND_PAD) U11.2(GND) U12.2(GND)
VIN: D4.1(A) JP11.1
NetC22_1: C22.1 D3.2(K) L5.1 U10.8(SW)
NetC22_2: C22.2 U10.1(BOOT)
NetC27_2: C27.2 R47.2 U10.6(COMP)
NetC28_2: C28.2 R47.1
NetD4_2: D4.2(K) F1.1(IN)
NetD5_1: D5.1(A) R51.2
NetR45_1: R45.1 R48.2 U10.5(FB)
NetR46_1: R46.1 R49.2 U10.3(EN)
NetR50_1: R50.1 U10.4(RT/CLK)

Not connected (* = marked no-connect by the designer): U11 4(NC)*; U12 4(NC)*

### Notes on the sheet
- (near J2) 5V 3.5A
- To I/O: VIN = 8.5V to 34V
- Lấy Vin = 12V
- (near U10) I out MAX = 3A
- (near U11) I limit = 300mA
- (near U12) I limit = 300mA
- Title
- Size:
- Date:
- A3
- Number:
- Time:
- Revision:
- Sheet
- of
- File:

### Library data of the parts
C22 C31-C34 = 0.1uF/50V/C0603/10%: 0.1µF ±10% 25V Ceramic Capacitor X7R 0805 (2012 Metric); Manufacturer: AVX Corporation; ComponentLink1URL: http://www.murata.com/~/media/webrenewal/support/library/catalog/products/capacitor/mlcc/c02e.ashx; ComponentLink1Description: http://www.murata.com/~/media/webrenewal/support/library/catalog/products/capacitor/mlcc/c02e.ashx; Digikey: 478-3755-1-ND
C23 C26 = 0.1uF/50V/C0603/10%: 47µF ±20% 10V Ceramic Capacitor X5R 0805 (2012 Metric); Manufacturer: Murata; ComponentLink1URL: http://www.murata.com/~/media/webrenewal/support/library/catalog/products/capacitor/mlcc/c02e.ashx; ComponentLink1Description: http://www.murata.com/~/media/webrenewal/support/library/catalog/products/capacitor/mlcc/c02e.ashx; Digikey: 490-9961-1-ND
C24 C25 = 1uF/50V/C0603/10%: 2.2µF ±10% 50V Ceramic Capacitor JB 0805 (2012 Metric); Manufacturer: TDK; ComponentLink1URL: http://www.samsungsem.com/kr/support/product-search/mlcc/CL21B105KBFNNNE.jsp; ComponentLink1Description: http://www.samsungsem.com/kr/support/product-search/mlcc/CL21B105KBFNNNE.jsp; Digikey: 445-11501-1-ND
C27 = 56pF/50V/C0603/5%: 39pF ±10% 50V Ceramic Capacitor C0G, NP0 0805 (2012 Metric); Manufacturer: KEMET; Digikey: 399-9232-1-ND
C28 = 10nF/50V/C0603/10%: 6800pF ±10% 25V Ceramic Capacitor X7R 0805 (2012 Metric); Manufacturer: Wurth Electronics Inc.; ComponentLink1URL: http://www.murata.com/~/media/webrenewal/support/library/catalog/products/capacitor/mlcc/c02e.ashx; ComponentLink1Description: http://www.murata.com/~/media/webrenewal/support/library/catalog/products/capacitor/mlcc/c02e.ashx; Digikey: 732-8054-1-ND
C29 C30 = TAJB106M025RNJ: 10µF Molded Tantalum Capacitors 25V 1411 (3528 Metric) 3 Ohm; Manufacturer: KEMET; Digikey: 399-5125-1-ND
D3 = 2#B560C-13-F: DIODE SCHOTTKY 60V 5A SMC; Digikey: B560C-FDICT-ND
D4 = 30# SK56L-TP: DIODE SCHOTTKY 60V 5A DO214AB; ComponentLink1URL: http://www.mccsemi.com/up_pdf/SK52L-SK510L(DO-214AB).PDF; ComponentLink1Description: http://www.mccsemi.com/up_pdf/SK52L-SK510L(DO-214AB).PDF; Digikey: SK56L-TPMSCT-ND
D5 = LED GREEN 0603: Green 571nm LED Indication - Discrete 2V 0805 (2012 Metric); ComponentLink1URL: http://optoelectronics.liteon.com/upload/download/DS22-2000-074/S_110_LTST-C190KGKT.pdf; ComponentLink1Description: http://optoelectronics.liteon.com/upload/download/DS22-2000-074/S_110_LTST-C190KGKT.pdf; Digikey: 160-1426-1-ND
F1 = 13#MF-SMDF050-2: PTC RESET FUSE 60V 550MA 2018; Digikey: MF-SMDF050-2CT-ND
J2-J4 = PAD 1mm: TPoint
JP11 = Con2: as JP3 on sheet Input; Digikey: ED2609-ND
L5 = Inductor: 8.2µH Shielded Wirewound Inductor 4A 68 mOhm Max Nonstandard; Digikey: ASPI-7318-8R2M-TCT-ND
R45 = 15K/R0603/1%: 53.6 kOhms ±1% 0.125W, 1/8W Chip Resistor 0805 (2012 Metric) Automotive AEC-Q200 Thick Film; ComponentLink1URL: http://www.yageo.com/NewPortal/yageodocoutput?fileName=/pdf/R-Chip/PYu-RC_Group_51_RoHS_L_3.pdf; ComponentLink1Description: http://www.yageo.com/NewPortal/yageodocoutput?fileName=/pdf/R-Chip/PYu-RC_Group_51_RoHS_L_3.pdf; Digikey: 541-53.6KCCT-ND
R46 = 249K/R0805/1%: 523 kOhms ±1% 0.125W, 1/8W Chip Resistor 0805 (2012 Metric) Automotive AEC-Q200 Thick Film; ComponentLink1URL: http://www.yageo.com/documents/recent/PYu-RC_Group_51_RoHS_L_8.pdf; ComponentLink1Description: http://www.yageo.com/documents/recent/PYu-RC_Group_51_RoHS_L_8.pdf; Digikey: 541-523KCCT-ND
R47 = 15K/R0603/1%: 13 kOhms ±1% 0.125W, 1/8W Chip Resistor 0805 (2012 Metric) Automotive AEC-Q200 Thick Film; ComponentLink1URL: http://www.yageo.com/NewPortal/yageodocoutput?fileName=/pdf/R-Chip/PYu-RC_Group_51_RoHS_L_3.pdf; ComponentLink1Description: http://www.yageo.com/NewPortal/yageodocoutput?fileName=/pdf/R-Chip/PYu-RC_Group_51_RoHS_L_3.pdf; Digikey: 541-13.0KCCT-ND
R48 = 3.3K/R0603/1%: 10.2 kOhms ±1% 0.125W, 1/8W Chip Resistor 0805 (2012 Metric) Automotive AEC-Q200 Thick Film; ComponentLink1URL: http://www.yageo.com/NewPortal/yageodocoutput?fileName=/pdf/R-Chip/PYu-RC_Group_51_RoHS_L_3.pdf; ComponentLink1Description: http://www.yageo.com/NewPortal/yageodocoutput?fileName=/pdf/R-Chip/PYu-RC_Group_51_RoHS_L_3.pdf; Digikey: 541-10.0KCCT-ND
R49 = 34.8K/R0805/1%: 84.5 kOhms ±1% 0.125W, 1/8W Chip Resistor 0805 (2012 Metric) Automotive AEC-Q200 Thick Film; Digikey: 541-84.5KCCT-ND
R50 = 200K/R0603/1%: 162 kOhms ±1% 0.125W, 1/8W Chip Resistor 0805 (2012 Metric) Automotive AEC-Q200 Thick Film; ComponentLink1URL: http://www.yageo.com/documents/recent/PYu-RC_Group_51_RoHS_L_7.pdf; ComponentLink1Description: http://www.yageo.com/documents/recent/PYu-RC_Group_51_RoHS_L_7.pdf; Digikey: 541-162KCCT-ND
R51 = 200K/R0603/1%: 1 kOhms ±1% 0.125W, 1/8W Chip Resistor 0805 (2012 Metric) Automotive AEC-Q200 Thick Film; Power (Watts): 0.1W, 1/10W; RoHS: RoHS Compliant; Category: Resistors; Part Status: Active; Features: Moisture Resistant; Operating Temperature: -55°C ~ 155°C; Package / Case: 0603 (1608 Metric); Supplier Device Package: 0603; Size / Dimension: 0.063" L x 0.031" W (1.60mm x 0.80mm); Height - Seated (Max): 0.022" (0.55mm); Failure Rate: -; ComponentLink1URL: http://www.yageo.com/documents/recent/PYu-RC_Group_51_RoHS_L_7.pdf; ComponentLink1Description: http://www.yageo.com/documents/recent/PYu-RC_Group_51_RoHS_L_7.pdf; Digikey: 541-1.00KCCT-ND
U10 = 21#TPS54360DDAR: Buck, Split Rail Switching Regulator IC Positive Adjustable 0.8V 1 Output 3.5A 8-PowerSOIC (0.154", 3.90mm Width); Digikey: 296-37676-1-ND
U11 U12 = 20#TLV73333PDBVR: Linear Voltage Regulator IC Positive Fixed 1 Output 3.3V 300mA SOT-23-5; Digikey: 296-40673-1-ND

## Sheet USB.SchDoc: USB TO UART/PROGRAM
size A3
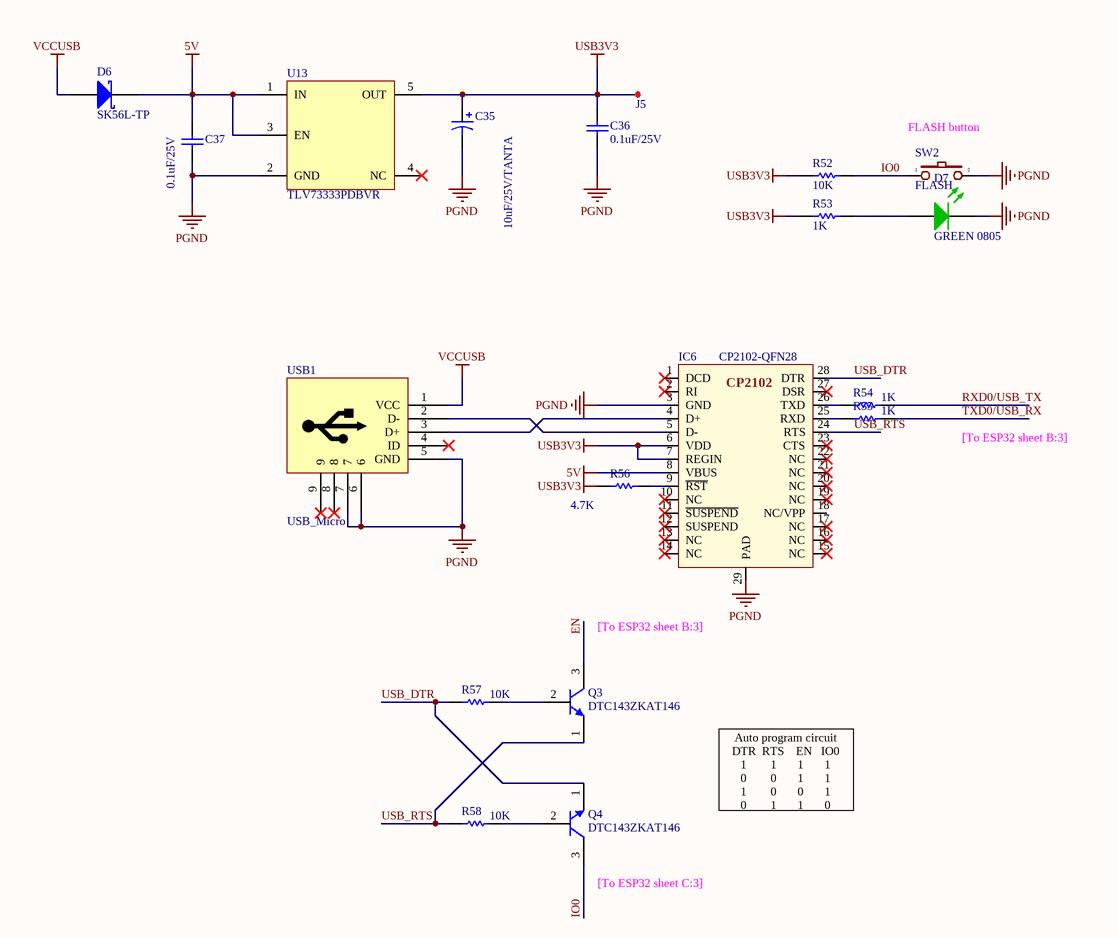
[diagram p5: USB.SchDoc]

### Parts
C35  10uF/25V/TANTA  [CAP TANT CASE B SMD]
C36  0.1uF/25V  [CAP_CERA_C2012(CC0805INCH)]
C37  0.1uF/25V  [CAP_CERA_C2012(CC0805INCH)]
D6  SK56L-TP  [30# SK56L-TPMSCT-ND]
D7  GREEN 0805  [Led 0805G]
IC6  CP2102-QFN28  [CP2102-QFN28]
J5  TEST POINT  [TEST POINT 1mm]  (value not drawn)
Q3  DTC143ZKAT146  [6# DTC143ZKAT146-E]
Q4  DTC143ZKAT146  [6# DTC143ZKAT146-E]
R52  10K  [Res 0805 SMD]
R53  1K  [Res 0805 SMD]
R54  1K  [Res 0805 SMD]
R55  1K  [Res 0805 SMD]
R56  4.7K  [Res 0805 SMD]
R57  10K  [Res 0805 SMD]
R58  10K  [Res 0805 SMD]
SW2  FLASH  [Button 3x4mm]
U13  TLV73333PDBVR  [20# TLV73333PDBVR - SOT23-65]
USB1  USB_Micro  [USB_MICRO_B - Digikey]

### Nets
5V: C37.2 D6.2(K) IC6.8(VBUS) U13.1(IN) U13.3(EN)
PGND: C35.2 C36.1 C37.1 D7.2(K) IC6.3(GND) IC6.29(PAD) SW2.2 U13.2(GND) USB1.5(GND) USB1.6 USB1.7
USB3V3: C35.1 C36.2 IC6.6(VDD) IC6.7(REGIN) J5.1(TP) R52.1 R53.1 R56.1 U13.5(OUT)
VCCUSB: D6.1(A) USB1.1(VCC)
EN: Q3.3(C)
IO0: Q4.3(C) R52.2 SW2.1
RXD0/USB_TX: R54.1
TXD0/USB_RX: R55.1
USB_DTR: IC6.28(DTR) Q4.1(E) R57.2
USB_RTS: IC6.24(RTS) Q3.1(E) R58.2
NetD7_1: D7.1(A) R53.2
NetIC6_4: IC6.4(D+) USB1.3(D+)
NetIC6_5: IC6.5(D-) USB1.2(D-)
NetIC6_9: IC6.9(~{RST}) R56.2
NetIC6_25: IC6.25(RXD) R55.2
NetIC6_26: IC6.26(TXD) R54.2
NetQ3_2: Q3.2(B) R57.1
NetQ4_2: Q4.2(B) R58.1

Not connected (* = marked no-connect by the designer): IC6 1(DCD)* 2(RI)* 10(NC)* 11(~{SUSPEND})* 12(SUSPEND)* 13(NC)* 14(NC)* 15(NC)* 16(NC)* 17(NC)* 18(NC/VPP) 19(NC)* 20(NC)* 21(NC)* 22(NC)* 23(CTS)* 27(DSR)*; U13 4(NC)*; USB1 4(ID)* 8* 9*

### Notes on the sheet
- (near SW2) FLASH button
- [To ESP32 sheet B:3]
- Auto program circuit
  DTR  RTS    EN   IO0
  1        1       1       1
  0        0       1       1
  1        0       0       1
  0        1       1       0
- (near Q4) [To ESP32 sheet C:3]
- Title
- Size:
- Date:
- A3
- Number:
- Time:
- Revision:
- Sheet
- of
- File:

### Library data of the parts
C35 = TAJB106M025RNJ: as C29 on sheet Power; Digikey: 399-5125-1-ND
C36 = 0.1uF/50V/C0603/10%: 0.1µF ±10% 25V Ceramic Capacitor X7R 0805 (2012 Metric); Manufacturer: KEMET; ComponentLink1URL: http://www.murata.com/~/media/webrenewal/support/library/catalog/products/capacitor/mlcc/c02e.ashx; ComponentLink1Description: http://www.murata.com/~/media/webrenewal/support/library/catalog/products/capacitor/mlcc/c02e.ashx; Digikey: 478-3755-1-ND
C37 = 0.1uF/50V/C0603/10%: as C2 on sheet ESP32; ComponentLink1URL: http://www.murata.com/~/media/webrenewal/support/library/catalog/products/capacitor/mlcc/c02e.ashx; ComponentLink1Description: http://www.murata.com/~/media/webrenewal/support/library/catalog/products/capacitor/mlcc/c02e.ashx; Digikey: 478-3755-1-ND
D6 = 30# SK56L-TP: DIODE SCHOTTKY 60V 5A DO214AB; ComponentLink1URL: http://www.mccsemi.com/up_pdf/SK52L-SK510L(DO-214AB).PDF; ComponentLink1Description: http://www.mccsemi.com/up_pdf/SK52L-SK510L(DO-214AB).PDF; Digikey: SK56L-TPMSCT-ND
D7 = LED GREEN 0603: as D5 on sheet Power; ComponentLink1URL: http://optoelectronics.liteon.com/upload/download/DS22-2000-074/S_110_LTST-C190KGKT.pdf; ComponentLink1Description: http://optoelectronics.liteon.com/upload/download/DS22-2000-074/S_110_LTST-C190KGKT.pdf; Digikey: 160-1426-1-ND
IC6 = CP2102: USB Bridge, USB to UART USB 2.0 UART Interface 28-QFN (5x5); Digikey: 336-3694-ND; VNBuy: https://banlinhkien.vn/goods-2607-cp2102-qfn28.html
J5 = PAD 1mm: TPoint
Q3 Q4 = 6#DTC143ZKAT146: Pre-Biased Bipolar Transistor (BJT) NPN - Pre-Biased 50V 100mA 250MHz 200mW Surface Mount SMT3; Digikey: DTC143ZKAT146CT-ND
R52 = 200K/R0603/1%: as R1 on sheet ESP32; RoHS: RoHS Compliant; Category: Resistors; Part Status: Active; Features: Moisture Resistant; Operating Temperature: -55°C ~ 155°C; Package / Case: 0603 (1608 Metric); Supplier Device Package: 0603; Size / Dimension: 0.063" L x 0.031" W (1.60mm x 0.80mm); Height - Seated (Max): 0.022" (0.55mm); Failure Rate: -; ComponentLink1URL: http://www.yageo.com/documents/recent/PYu-RC_Group_51_RoHS_L_7.pdf; ComponentLink1Description: http://www.yageo.com/documents/recent/PYu-RC_Group_51_RoHS_L_7.pdf; Digikey: A126332CT-ND
R53 = 200K/R0603/1%: as R51 on sheet Power; RoHS: RoHS Compliant; Category: Resistors; Part Status: Active; Features: Moisture Resistant; Operating Temperature: -55°C ~ 155°C; Package / Case: 0603 (1608 Metric); Supplier Device Package: 0603; Size / Dimension: 0.063" L x 0.031" W (1.60mm x 0.80mm); Height - Seated (Max): 0.022" (0.55mm); Failure Rate: -; ComponentLink1URL: http://www.yageo.com/documents/recent/PYu-RC_Group_51_RoHS_L_7.pdf; ComponentLink1Description: http://www.yageo.com/documents/recent/PYu-RC_Group_51_RoHS_L_7.pdf; Digikey: 541-1.00KCCT-ND
R54 R55 = 34.8K/R0805/1%: 1 kOhms ±1% 0.125W, 1/8W Chip Resistor 0805 (2012 Metric) Automotive AEC-Q200 Thick Film; Power Rating: 100mW; Resistance: 34.8kR; Voltage Rating: 50V; Case/Package: 0603; Case Code (Imperial): 0603; Case Code (Metric): 1608; Min Operating Temperature: -55°C; Max Operating Temperature: 155°C; Termination: SMD/SMT; Military Standard: Not; Voltage Rating (DC): 50V; Length: 1.6mm; Height: 0.45mm; Width: 0.8mm; Depth: 0.8mm; Lead Free: Lead Free; Digikey: 541-1.00KCCT-ND
R56 = 34.8K/R0805/1%: 4.7 kOhms ±1% 0.125W, 1/8W Chip Resistor 0805 (2012 Metric) Thick Film; Digikey: 541-4131-1-ND
R57 R58 = 34.8K/R0805/1%: 10 kOhms ±1% 0.125W, 1/8W Chip Resistor 0805 (2012 Metric) Thick Film; Power Rating: 100mW; Resistance: 34.8kR; Voltage Rating: 50V; Case/Package: 0603; Case Code (Imperial): 0603; Case Code (Metric): 1608; Min Operating Temperature: -55°C; Max Operating Temperature: 155°C; Termination: SMD/SMT; Military Standard: Not; Voltage Rating (DC): 50V; Length: 1.6mm; Height: 0.45mm; Width: 0.8mm; Depth: 0.8mm; Lead Free: Lead Free; Digikey: A126332CT-ND
SW2 = SW2: SWITCH TACTILE SPST-NO 0.05A 12V; Digikey: CKN10384CT-ND
U13 = 20#TLV73333PDBVR: as U11 on sheet Power; Digikey: 296-40673-1-ND
USB1 = USB_MINI: USB - micro B USB 2.0 Receptacle Connector 5 Position Surface Mount, Right Angle; Through Hole; BuyVN: https://banlinhkien.vn/goods-5145-microusb-mk5p-dip.html; Digikey: 609-4618-1-ND

## Sheet CAN.SchDoc: CAN
size A3

### Notes on the sheet
- Title
- Size:
- Date:
- A3
- Number:
- Time:
- Revision:
- Sheet
- of
- File:

## Nets that join several sheets
3.3V_ESP: ESP32 (C1.2 C2.2 R1.1 U1.2), Input (U2.4 U3.4 U4.4), Output (5 pins), Power (C29.1 C31.2 J3.1 U11.5)
3.3V_ETHER: Ethernet (22 pins), Power (C30.1 C32.2 J4.1 U12.5)
5V: Output (9 pins), Power (12 pins), USB (5 pins)
12V: Input (8 pins), Power (5 pins)
PGND: ESP32 (L1.2), Ethernet (L3.2 L4.2), Input (9 pins), Output (8 pins), Power (22 pins), USB (11 pins)
EMAC_CRS_DV: ESP32 (U1.12), Ethernet (IC2.11 R17.2)
EMAC_MDC: ESP32 (U1.27), Ethernet (IC2.13)
EMAC_MDIO: ESP32 (U1.28), Ethernet (IC2.12 R16.2)
EMAC_RXD0: ESP32 (U1.10), Ethernet (IC2.8 R14.2)
EMAC_RXD1: ESP32 (U1.11), Ethernet (IC2.7 R15.2)
EMAC_TX_EN: ESP32 (U1.33), Ethernet (IC2.16)
EMAC_TXD0: ESP32 (U1.31), Ethernet (IC2.17)
EMAC_TXD1: ESP32 (U1.36), Ethernet (IC2.18)
EN: ESP32 (C3.2 R1.2 R2.2 U1.3), Ethernet (C17.2 IC3.2 R19.2), USB (Q3.3)
ESP_BUTTON: ESP32 (U1.4), Input (R39.2 U4.3)
IO0: ESP32 (U1.25), Ethernet (IC2.5 R24.2), USB (Q4.3 R52.2 SW2.1)